# Altium schematic sheet 4-20.SchDoc
size A3
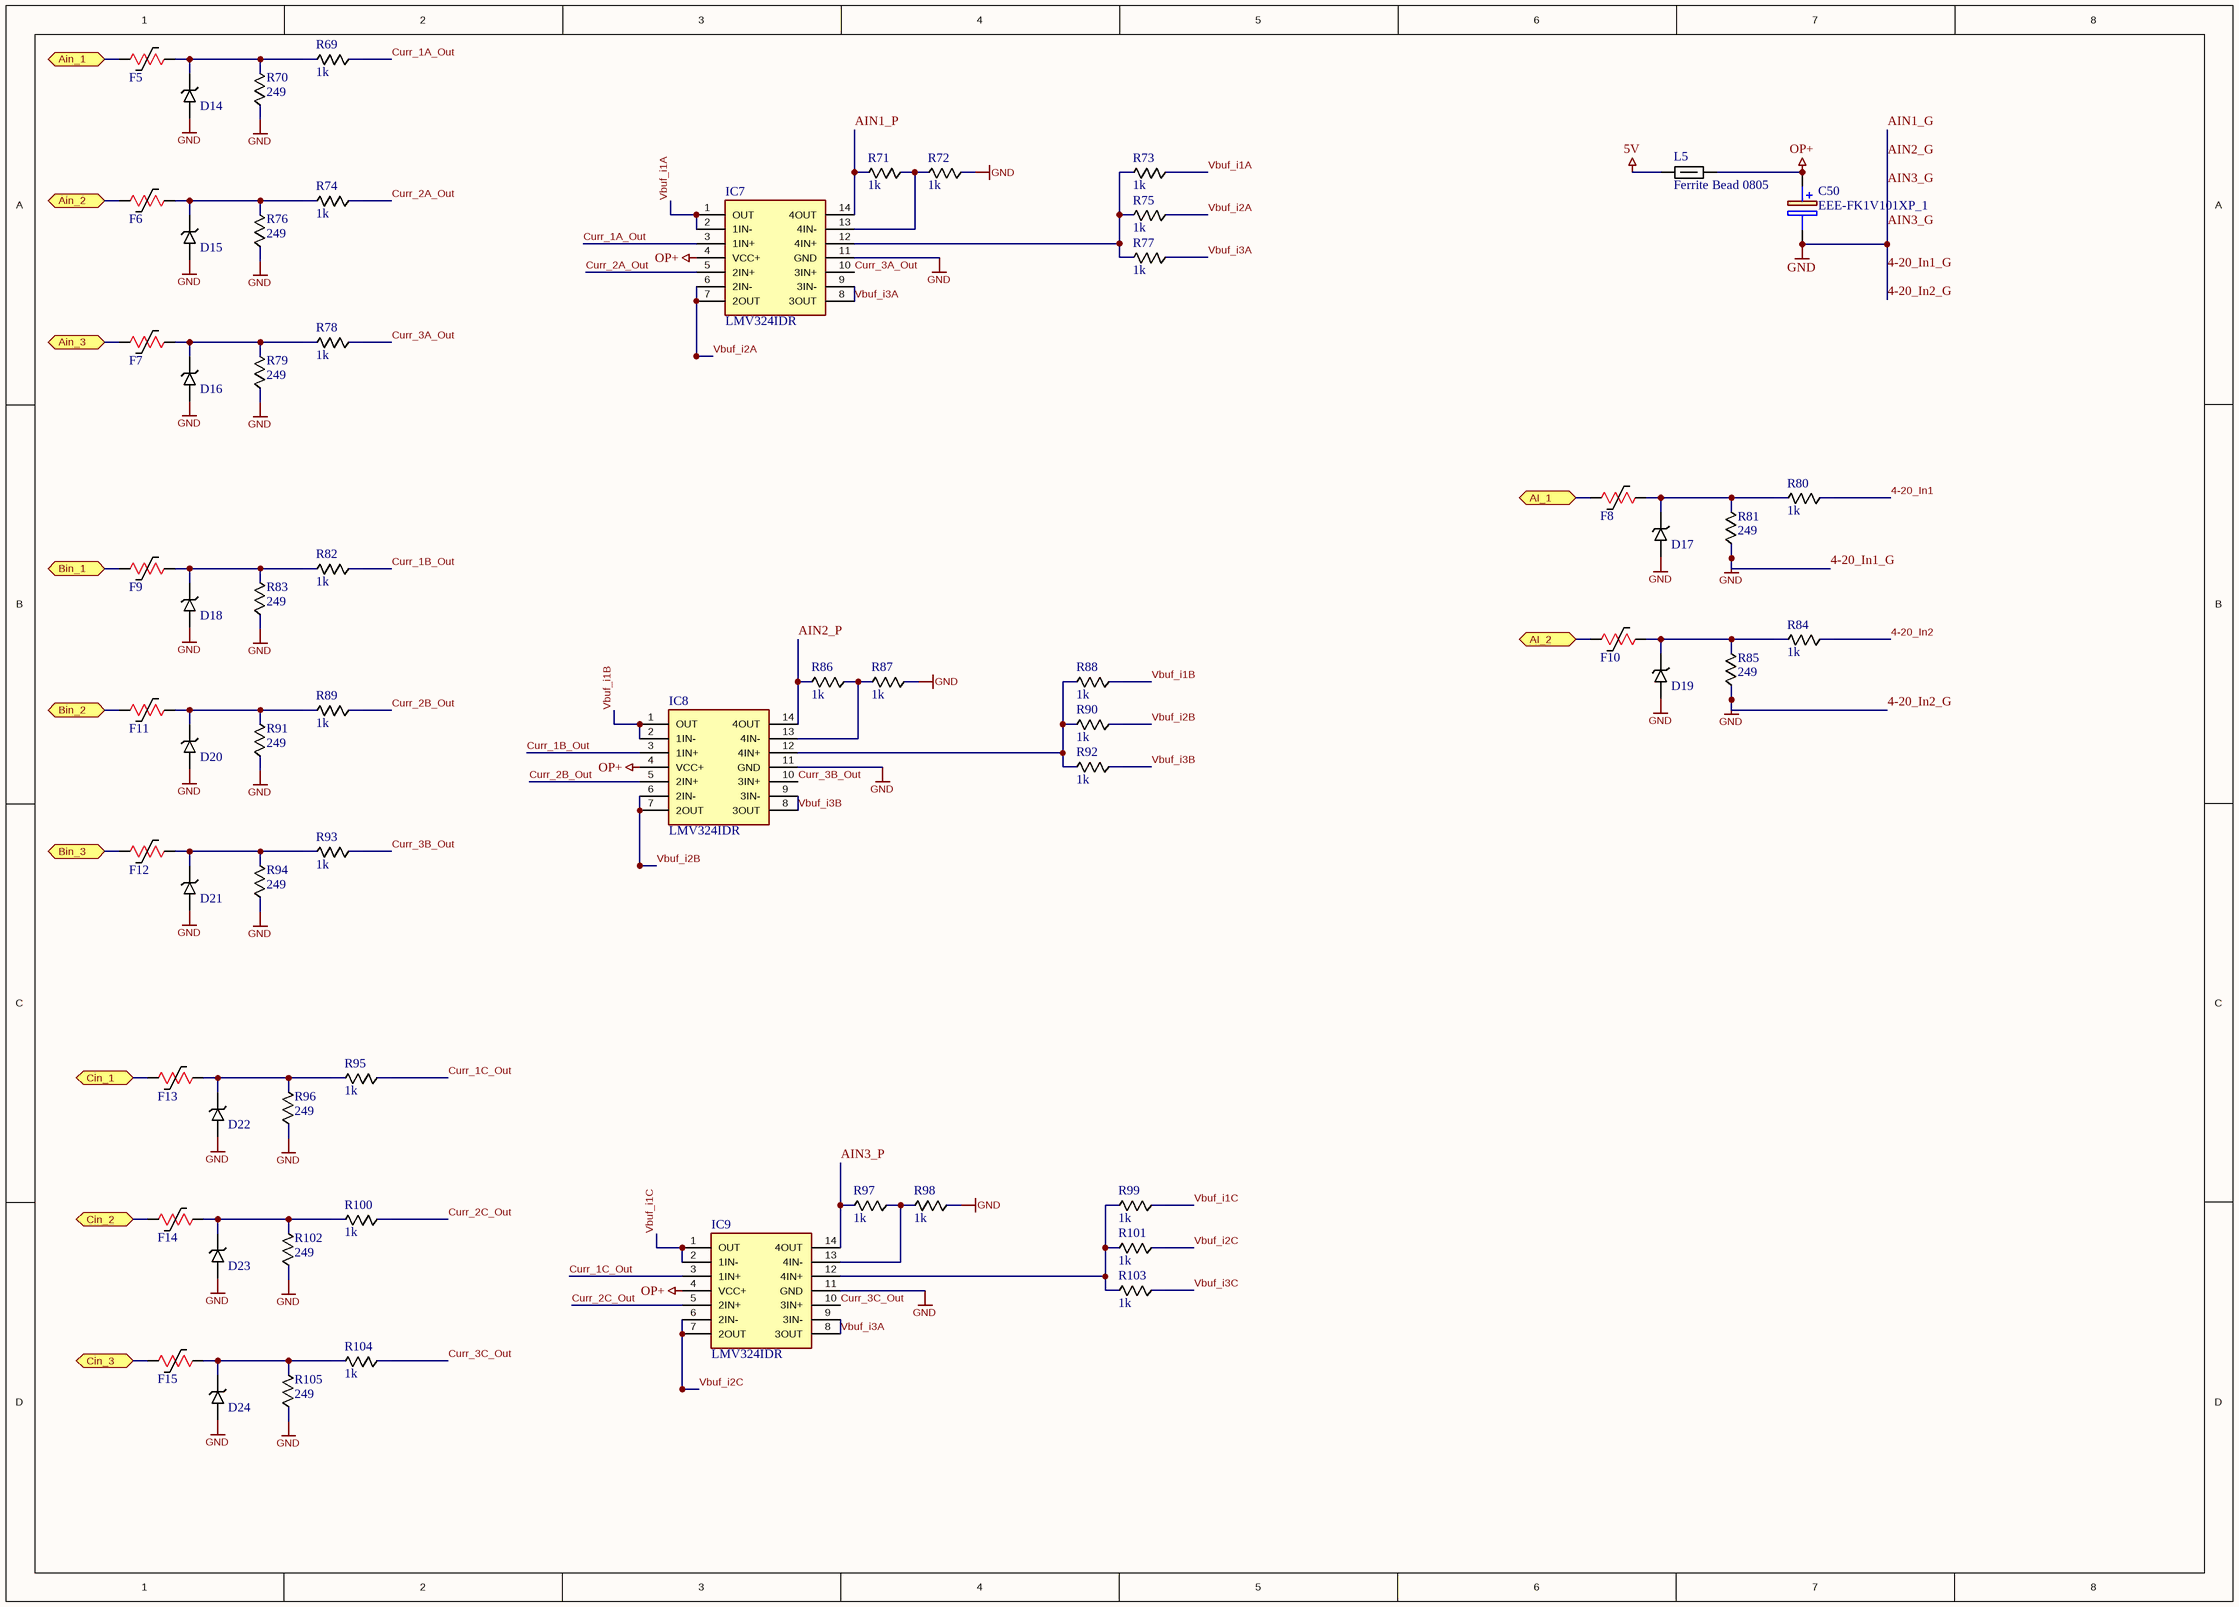
[diagram p0: 4-20.SchDoc]

## Parts
C50  EEE-FK1V101XP_1  [EEE1AA220WR]
D14  TVS Diode  [DO-214AC / SMA - POL]  (value not drawn)
D15  TVS Diode  [DO-214AC / SMA - POL]  (value not drawn)
D16  TVS Diode  [DO-214AC / SMA - POL]  (value not drawn)
D17  TVS Diode  [DO-214AC / SMA - POL]  (value not drawn)
D18  TVS Diode  [DO-214AC / SMA - POL]  (value not drawn)
D19  TVS Diode  [DO-214AC / SMA - POL]  (value not drawn)
D20  TVS Diode  [DO-214AC / SMA - POL]  (value not drawn)
D21  TVS Diode  [DO-214AC / SMA - POL]  (value not drawn)
D22  TVS Diode  [DO-214AC / SMA - POL]  (value not drawn)
D23  TVS Diode  [DO-214AC / SMA - POL]  (value not drawn)
D24  TVS Diode  [DO-214AC / SMA - POL]  (value not drawn)
F5  MF-USMF005-2  [MF-MSMF030-2]  (value not drawn)
F6  MF-USMF005-2  [MF-MSMF030-2]  (value not drawn)
F7  MF-USMF005-2  [MF-MSMF030-2]  (value not drawn)
F8  MF-USMF005-2  [MF-MSMF030-2]  (value not drawn)
F9  MF-USMF005-2  [MF-MSMF030-2]  (value not drawn)
F10  MF-USMF005-2  [MF-MSMF030-2]  (value not drawn)
F11  MF-USMF005-2  [MF-MSMF030-2]  (value not drawn)
F12  MF-USMF005-2  [MF-MSMF030-2]  (value not drawn)
F13  MF-USMF005-2  [MF-MSMF030-2]  (value not drawn)
F14  MF-USMF005-2  [MF-MSMF030-2]  (value not drawn)
F15  MF-USMF005-2  [MF-MSMF030-2]  (value not drawn)
IC7  LMV324IDR  [SOIC14N]
IC8  LMV324IDR  [SOIC14N]
IC9  LMV324IDR  [SOIC14N]
L5  Ferrite Bead 0805  [BLM21AG102BH1J]
R69  1k  [0603 CAP]
R70  249  [1206 Res]
R71  1k  [0603 CAP]
R72  1k  [0603 CAP]
R73  1k  [0603 CAP]
R74  1k  [0603 CAP]
R75  1k  [0603 CAP]
R76  249  [1206 Res Kelvin]
R77  1k  [0603 CAP]
R78  1k  [0603 CAP]
R79  249  [1206 Res Kelvin]
R80  1k  [0603 CAP]
R81  249  [1206 Res Kelvin]
R82  1k  [0603 CAP]
R83  249  [1206 Res Kelvin]
R84  1k  [0603 CAP]
R85  249  [1206 Res Kelvin]
R86  1k  [0603 CAP]
R87  1k  [0603 CAP]
R88  1k  [0603 CAP]
R89  1k  [0603 CAP]
R90  1k  [0603 CAP]
R91  249  [1206 Res Kelvin]
R92  1k  [0603 CAP]
R93  1k  [0603 CAP]
R94  249  [1206 Res Kelvin]
R95  1k  [0603 CAP]
R96  249  [1206 Res Kelvin]
R97  1k  [0603 CAP]
R98  1k  [0603 CAP]
R99  1k  [0603 CAP]
R100  1k  [0603 CAP]
R101  1k  [0603 CAP]
R102  249  [1206 Res Kelvin]
R103  1k  [0603 CAP]
R104  1k  [0603 CAP]
R105  249  [1206 Res Kelvin]

## Ports
AI_1, AI_2, Ain_1, Ain_2, Ain_3, Bin_1, Bin_2, Bin_3, Cin_1, Cin_2, Cin_3

## Nets
4-20_In1_G: C50.2(-) D14.1 D15.1 D16.1 D17.1 D18.1 D19.1 D20.1 D21.1 D22.1 D23.1 D24.1 IC7.11(GND) IC8.11(GND) IC9.11(GND) R70.1 R72.1 R76.1 R79.1 R81.1 R83.1 R85.1 R87.1 R91.1 R94.1 R96.1 R98.1 R102.1 R105.1  [also labelled 4-20_In2_G, AIN1_G, AIN2_G, AIN3_G, GND]
5V: L5.1
OP+: C50.1(+) IC7.4(VCC+) IC8.4(VCC+) IC9.4(VCC+) L5.2
4-20_In1: R80.1
4-20_In2: R84.1
AI_1: F8.2 ; port AI_1
AI_2: F10.2 ; port AI_2
AIN1_P: IC7.14(4OUT) R71.2
AIN2_P: IC8.14(4OUT) R86.2
AIN3_P: IC9.14(4OUT) R97.2
Ain_1: F5.2 ; port Ain_1
Ain_2: F6.2 ; port Ain_2
Ain_3: F7.2 ; port Ain_3
Bin_1: F9.2 ; port Bin_1
Bin_2: F11.2 ; port Bin_2
Bin_3: F12.2 ; port Bin_3
Cin_1: F13.2 ; port Cin_1
Cin_2: F14.2 ; port Cin_2
Cin_3: F15.2 ; port Cin_3
Curr_1A_Out: IC7.3(1IN+) R69.1
Curr_1B_Out: IC8.3(1IN+) R82.1
Curr_1C_Out: IC9.3(1IN+) R95.1
Curr_2A_Out: IC7.5(2IN+) R74.1
Curr_2B_Out: IC8.5(2IN+) R89.1
Curr_2C_Out: IC9.5(2IN+) R100.1
Curr_3A_Out: IC7.10(3IN+) R78.1
Curr_3B_Out: IC8.10(3IN+) R93.1
Curr_3C_Out: IC9.10(3IN+) R104.1
Vbuf_i1A: IC7.1(OUT) IC7.2(1IN-) R73.1
Vbuf_i1B: IC8.1(OUT) IC8.2(1IN-) R88.1
Vbuf_i1C: IC9.1(OUT) IC9.2(1IN-) R99.1
Vbuf_i2A: IC7.6(2IN-) IC7.7(2OUT) R75.1
Vbuf_i2B: IC8.6(2IN-) IC8.7(2OUT) R90.1
Vbuf_i2C: IC9.6(2IN-) IC9.7(2OUT) R101.1
Vbuf_i3A: IC7.8(3OUT) IC7.9(3IN-) IC9.8(3OUT) IC9.9(3IN-) R77.1
Vbuf_i3B: IC8.8(3OUT) IC8.9(3IN-) R92.1
Vbuf_i3C: R103.1
NetD14_2: D14.2 F5.1 R69.2 R70.2
NetD15_2: D15.2 F6.1 R74.2 R76.2
NetD16_2: D16.2 F7.1 R78.2 R79.2
NetD17_2: D17.2 F8.1 R80.2 R81.2
NetD18_2: D18.2 F9.1 R82.2 R83.2
NetD19_2: D19.2 F10.1 R84.2 R85.2
NetD20_2: D20.2 F11.1 R89.2 R91.2
NetD21_2: D21.2 F12.1 R93.2 R94.2
NetD22_2: D22.2 F13.1 R95.2 R96.2
NetD23_2: D23.2 F14.1 R100.2 R102.2
NetD24_2: D24.2 F15.1 R104.2 R105.2
NetIC7_12: IC7.12(4IN+) R73.2 R75.2 R77.2
NetIC7_13: IC7.13(4IN-) R71.1 R72.2
NetIC8_12: IC8.12(4IN+) R88.2 R90.2 R92.2
NetIC8_13: IC8.13(4IN-) R86.1 R87.2
NetIC9_12: IC9.12(4IN+) R99.2 R101.2 R103.2
NetIC9_13: IC9.13(4IN-) R97.1 R98.2

## Library data of the parts
C50 = EEE-FK1V101XP_1: EEEFK1C100R; Manufacturer_Name: Panasonic; Datasheet Link: http://industrial.panasonic.com/cdbs/www-data/pdf/RDE0000/ABA0000C1181.pdf; Height: 7.8mm; Manufacturer_Part_Number: EEE-FK1V101XP; Mouser Part Number: 667-EEE-FK1V101XP; Mouser Price/Stock: https://www.mouser.co.uk/ProductDetail/Panasonic/EEE-FK1V101XP?qs=qE6bgDGEOCu46KIpIgG5Yw%3D%3D; Arrow Part Number: EEE-FK1V101XP; Arrow Price/Stock: https://www.arrow.com/en/products/eee-fk1v101xp/panasonic?utm_currency=USD&region=europe
D14-D24 = TVS_1_Uni_1: PESD5V0U1UB
F5-F15 = Fuse Resettable: Resettable Fuse Polyswitch
IC7-IC9 = LMV324IDR: Integrated Circuit; Manufacturer_Name: Texas Instruments; Datasheet Link: https://www.ti.com/lit/ds/symlink/lmv324.pdf?ts=1614057377514&ref_url=https%253A%252F%252Fwww.ti.com%252Fstore%252Fti%252Fen%252Fp%252Fproduct%252F%253Fp%253DLMV324IDR; Height: 1.75mm; Manufacturer_Part_Number: LMV324IDR; Mouser Part Number: 595-LMV324IDR; Mouser Price/Stock: https://www.mouser.co.uk/ProductDetail/Texas-Instruments/LMV324IDR?qs=q2XTDbzbm6Ccfg2cd2%252BySw%3D%3D; Arrow Part Number: LMV324IDR; Arrow Price/Stock: https://www.arrow.com/en/products/lmv324idr/texas-instruments?utm_currency=USD&region=nac
L5 = Ferrite Bead
R69 R71-R75 R77 R78 R80 R82 R84 R86-R90 R92 R93 R95 R97-R101 R103 R104 = 0603 RES
R70 = RES 1206: RC1206FR-07249RL
R76 R79 R81 R83 R85 R91 R94 R96 R102 R105 = RES 1206: RT1206BRD07249RL